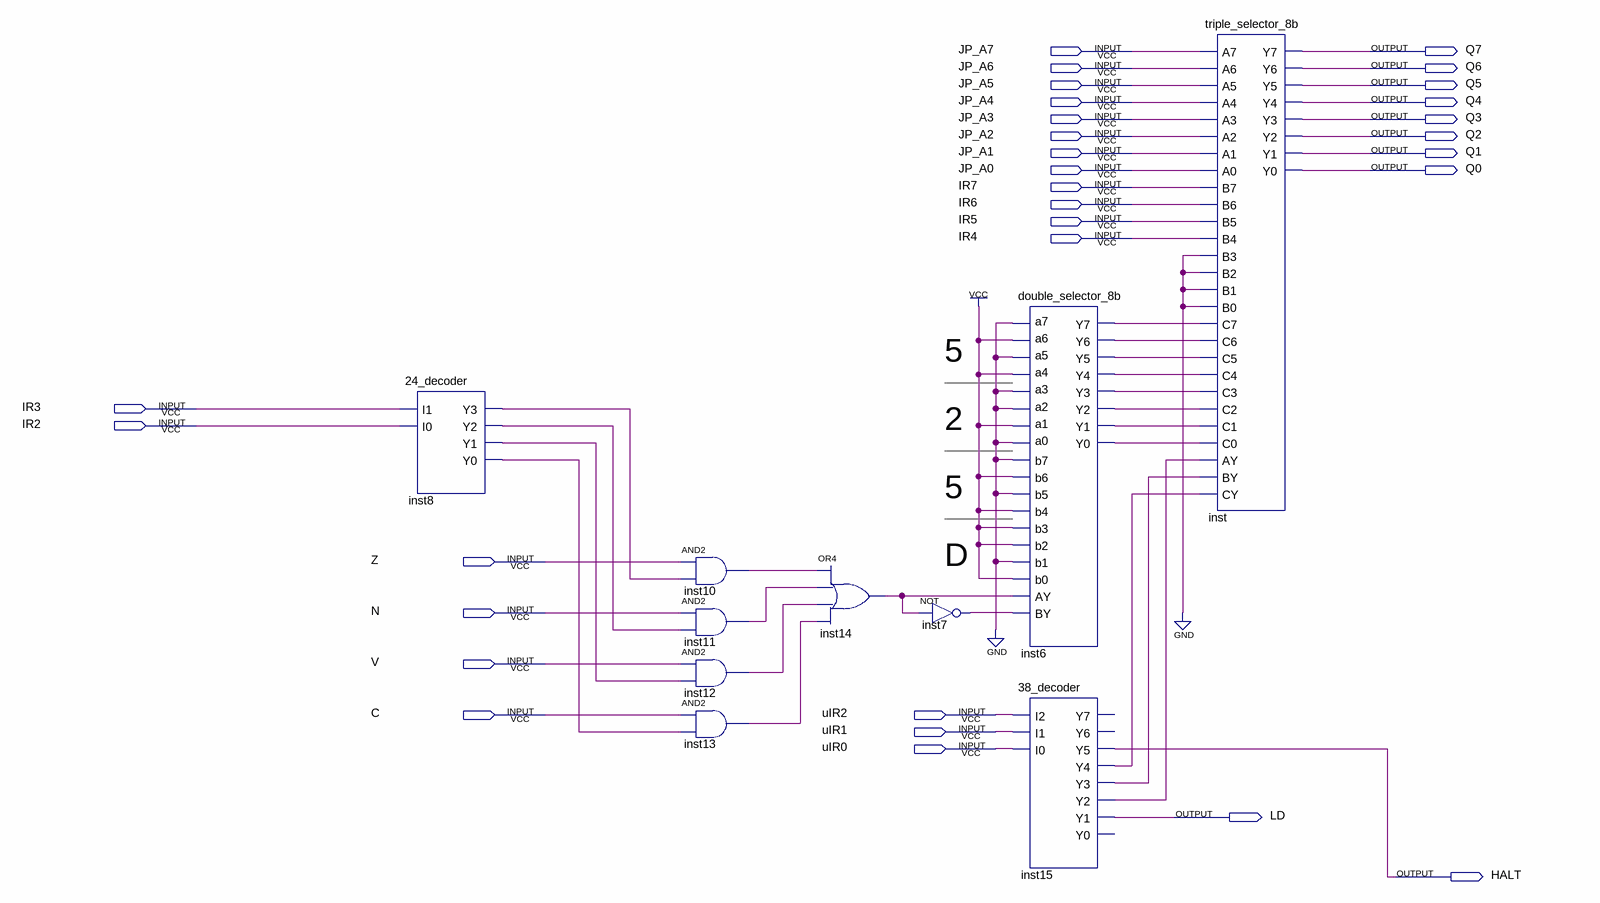
[diagram p0: schematic sheet]
// Quartus schematic micro_address_generator.bdf as structural Verilog: 10 symbols, 31 pins
module micro_address_generator (
  input  JP_A7,
  input  JP_A6,
  input  JP_A5,
  input  JP_A4,
  input  JP_A3,
  input  JP_A2,
  input  JP_A1,
  input  JP_A0,
  input  IR7,
  input  IR6,
  input  IR5,
  input  IR4,
  input  IR3,
  input  IR2,
  input  Z,
  input  N,
  input  V,
  input  C,
  input  uIR2,
  input  uIR1,
  input  uIR0,
  output Q7,
  output Q6,
  output Q5,
  output Q4,
  output Q3,
  output Q2,
  output Q1,
  output Q0,
  output LD,
  output HALT
);

  wire inst6_y0, inst6_y1, inst6_y2, inst6_y3, inst6_y4, inst6_y5, inst6_y6, inst6_y7, inst7_out, inst8_y0,
       inst8_y1, inst8_y2, inst8_y3, inst10_out, inst11_out, inst12_out, inst13_out, inst14_out, inst15_y2,
       inst15_y3, inst15_y4;

  \24_decoder  inst8 (.I1(IR3), .I0(IR2), .Y3(inst8_y3), .Y2(inst8_y2), .Y1(inst8_y1), .Y0(inst8_y0));
  and inst10 (inst10_out, Z, inst8_y3);
  and inst11 (inst11_out, N, inst8_y2);
  and inst12 (inst12_out, V, inst8_y1);
  and inst13 (inst13_out, C, inst8_y0);
  or inst14 (inst14_out, inst10_out, inst11_out, inst12_out, inst13_out);
  not inst7 (inst7_out, inst14_out);
  double_selector_8b inst6 (
    .a0(1'b0), .a1(1'b1), .a2(1'b0), .a3(1'b0), .a4(1'b1), .a5(1'b0), .a6(1'b1), .a7(1'b0), .b0(1'b1),
    .b1(1'b0), .b2(1'b1), .b3(1'b1), .b4(1'b1), .b5(1'b0), .b6(1'b1), .b7(1'b0), .AY(inst14_out),
    .BY(inst7_out), .Y0(inst6_y0), .Y1(inst6_y1), .Y2(inst6_y2), .Y3(inst6_y3), .Y4(inst6_y4), .Y5(inst6_y5),
    .Y6(inst6_y6), .Y7(inst6_y7));
  \38_decoder  inst15 (
    .I2(uIR2), .I1(uIR1), .I0(uIR0), .Y5(HALT), .Y4(inst15_y4), .Y3(inst15_y3), .Y2(inst15_y2), .Y1(LD));  // open: Y7, Y6, Y0
  triple_selector_8b inst (
    .A7(JP_A7), .B7(IR7), .C7(inst6_y7), .A6(JP_A6), .B6(IR6), .C6(inst6_y6), .A5(JP_A5), .B5(IR5),
    .C5(inst6_y5), .A4(JP_A4), .B4(IR4), .C4(inst6_y4), .A3(JP_A3), .B3(1'b0), .C3(inst6_y3), .A2(JP_A2),
    .B2(1'b0), .C2(inst6_y2), .A1(JP_A1), .B1(1'b0), .C1(inst6_y1), .A0(JP_A0), .B0(1'b0), .C0(inst6_y0),
    .AY(inst15_y2), .BY(inst15_y3), .CY(inst15_y4), .Y7(Q7), .Y6(Q6), .Y5(Q5), .Y4(Q4), .Y3(Q3), .Y2(Q2),
    .Y1(Q1), .Y0(Q0));

  // Notes on the sheet:
  //   5
  //   2
  //   5
  //   D
endmodule
